# EAGLE schematic MSP-EXP430F5529LP (EAGLE 6.5.0)

## Sheet 1 of 3
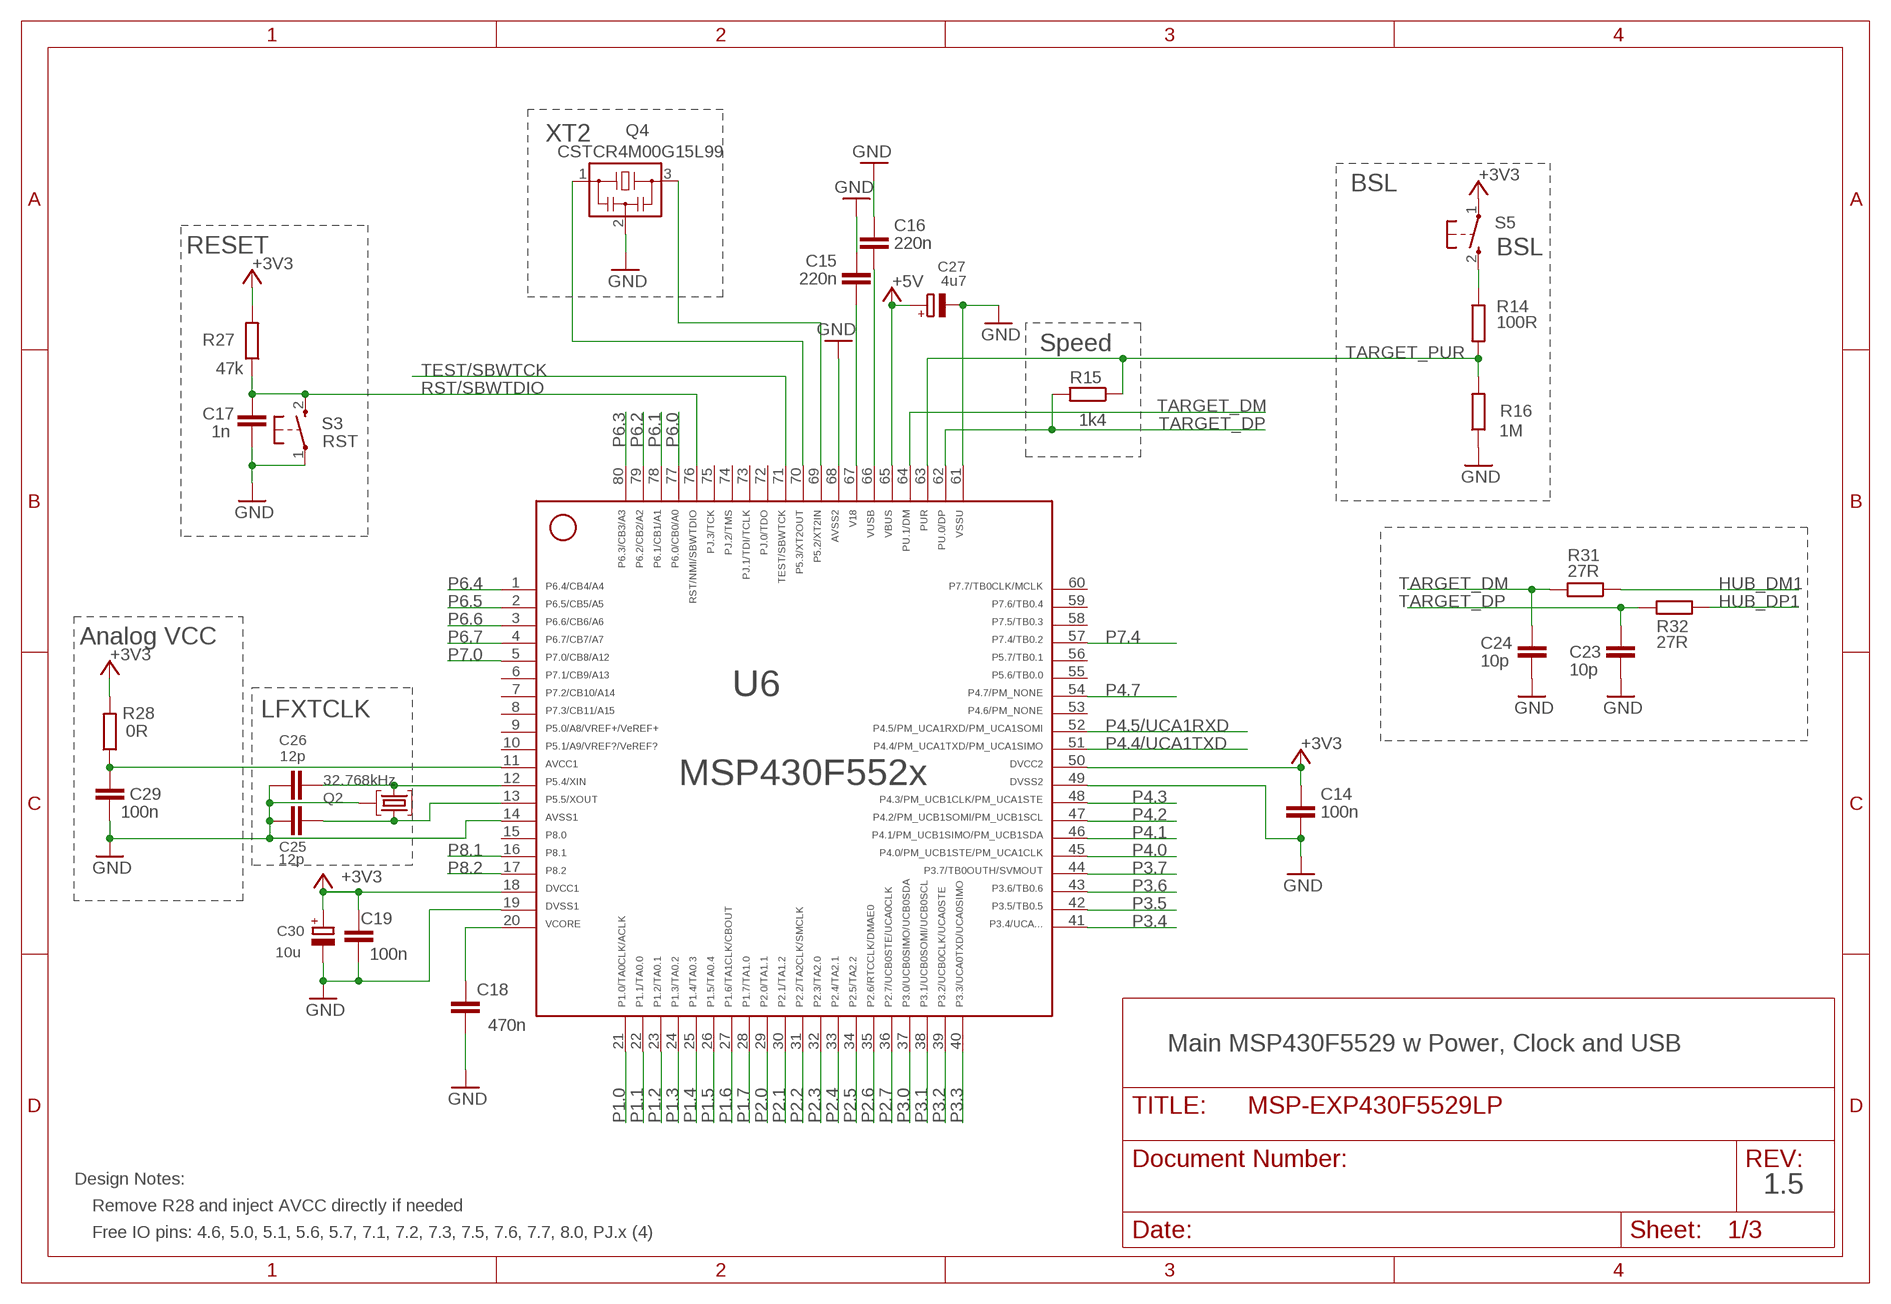
[diagram p0: schematic, sheet 1]

### Parts
C14  100n  C-EUC0402  [C0402]
C15  220n  C-EUC0402  [C0402]
C16  220n  C-EUC0402  [C0402]
C17  1n  C-EUC0402  [C0402]
C18  470n  C-EUC0402  [C0402]
C19  100n  C-EUC0402  [C0402]
C23  10p  C-EUC0402  [C0402]
C24  10p  C-EUC0402  [C0402]
C25  12p  C-EUC0402  [C0402]
C26  12p  C-EUC0402  [C0402]
C27  4u7  CPOL-EUA/3216-18R  [A/3216-18R]
C29  100n  C-EUC0402  [C0402]
C30  10u  CPOL-EUA/3216-18R  [A/3216-18R]
Q2  32.768kHz  MS3V-T1R  [MS3V-T1R]
Q4  CSTCR4M00G15L99  MURATA-FILTER_CSTCR6M00G53Z  [MURATA-FILTER_CSTCR]
R14  100R  R-EU_R0402  [R0402]
R15  1k4  R-EU_R0402  [R0402]
R16  1M  R-EU_R0402  [R0402]
R27  47k  R-EU_R0402  [R0402]
R28  0R  R-EU_R0402  [R0402]
R31  27R  R-EU_R0402  [R0402]
R32  27R  R-EU_R0402  [R0402]
S3  RST  PB  [PBTH]
S5  BSL  PB  [PBTH]
U6  MSP430F5529IPNR  F552X---PN80  [PN80]

### Nets
+3V3 [Power]: C14.1 C19.2 C30.+ R27.2 R28.2 S5.1(P) U6.18 U6.50 ; also sheet 2
+5V [Power]: C27.+ U6.65 ; also sheet 2
AVCC [Power]: C29.1 R28.1 U6.11
GND [Ground]: C14.2 C15.2 C16.2 C17.2 C18.1 C19.1 C23.2 C24.2 C25.1 C26.1 C27.- C29.2 C30.- Q2.P3(GND) Q4.2 R16.1 S3.1(P) U6.14 U6.19 U6.49 U6.61 U6.68 ; also sheet 2,3
HUB_DM1: R31.1
HUB_DP1: R32.1
N$4: R14.1 S5.2(S)
P1.0: U6.21
P1.1: U6.22
P1.2: U6.23
P1.3: U6.24
P1.4: U6.25
P1.5: U6.26
P1.6: U6.27
P1.7: U6.28
P2.0: U6.29
P2.1: U6.30
P2.2: U6.31
P2.3: U6.32
P2.4: U6.33
P2.5: U6.34
P2.6: U6.35
P2.7: U6.36
P3.0: U6.37
P3.1: U6.38
P3.2: U6.39
P3.3: U6.40
P3.4: U6.41
P3.5: U6.42
P3.6: U6.43
P3.7: U6.44
P4.0: U6.45
P4.1: U6.46
P4.2: U6.47
P4.3: U6.48
P4.4/UCA1TXD: U6.51
P4.5/UCA1RXD: U6.52
P4.7: U6.54
P5.2/XT2IN: Q4.3 U6.69
P5.3/XT2OUT: Q4.1 U6.70
P5.4/XIN: C26.2 Q2.P2 U6.12
P5.5/XOUT: C25.2 Q2.P1 U6.13
P6.0: U6.77
P6.1: U6.78
P6.2: U6.79
P6.3: U6.80
P6.4: U6.1
P6.5: U6.2
P6.6: U6.3
P6.7: U6.4
P7.0: U6.5
P7.4: U6.57
P8.1: U6.16
P8.2: U6.17
RST/SBWTDIO: C17.1 R27.1 S3.2(S) U6.76
TARGET_DM: C24.1 R31.2 U6.64
TARGET_DP: C23.1 R15.2 R32.2 U6.62
TARGET_PUR: R14.2 R15.1 R16.2 U6.63
TARGET_VUSB [Power]: C16.1 U6.66
TEST/SBWTCK: U6.71
V18 [Power]: C15.1 U6.67
VCORE [Power]: C18.2 U6.20
Unconnected: U6.6 U6.7 U6.8 U6.9 U6.10 U6.15 U6.53 U6.55 U6.56 U6.58 U6.59 U6.60 U6.72 U6.73 U6.74 U6.75

### Notes on the sheet
- XT2
- BSL
- RESET
- Speed
- Analog VCC
- LFXTCLK
- Main MSP430F5529 w Power, Clock and USB
- Design Notes:
- 1.5
- Remove R28 and inject AVCC directly if needed
- Free IO pins: 4.6, 5.0, 5.1, 5.6, 5.7, 7.1, 7.2, 7.3, 7.5, 7.6, 7.7, 8.0, PJ.x (4)

## Sheet 2 of 3
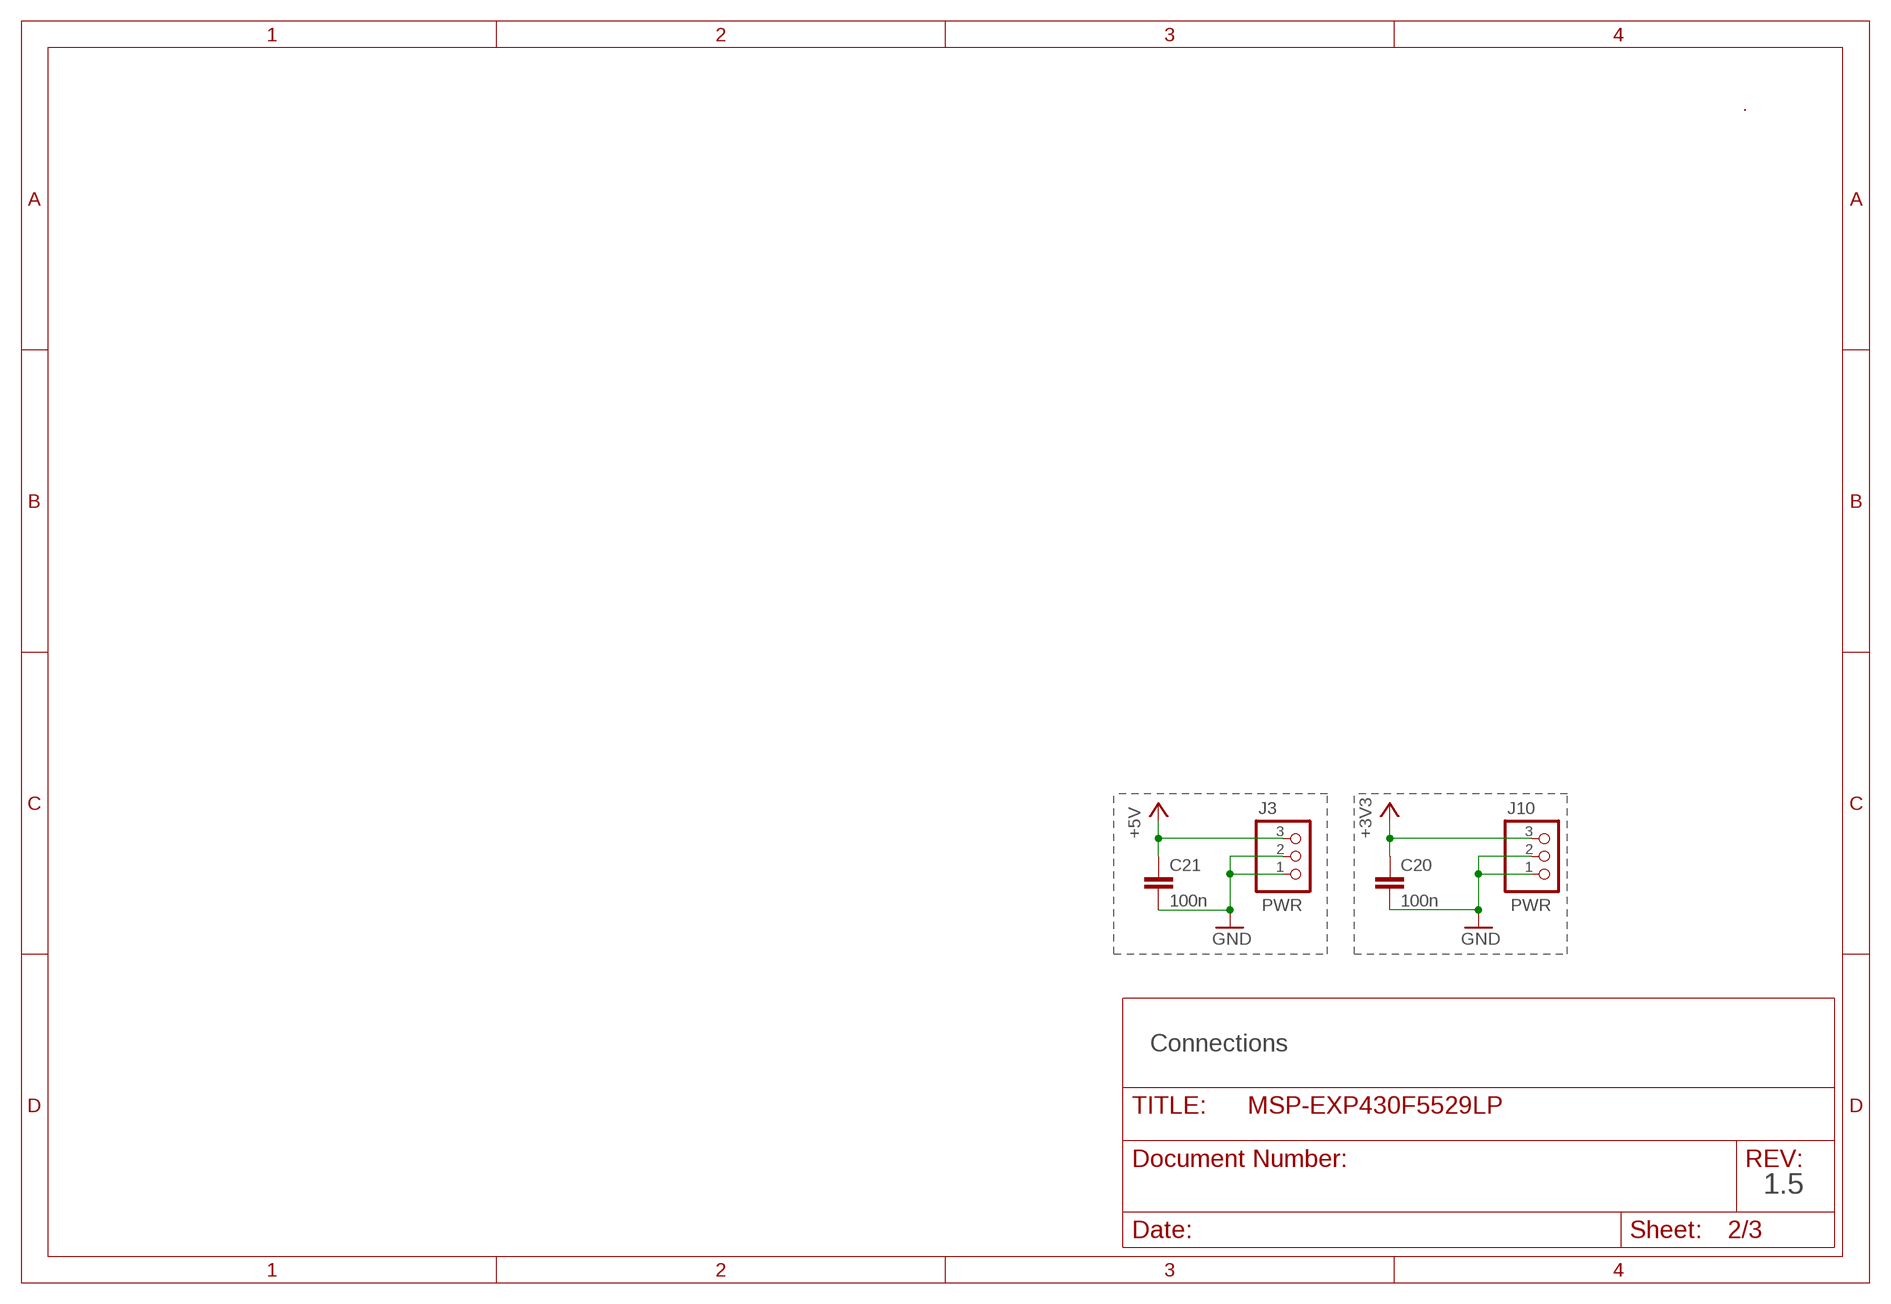
[diagram p1: schematic, sheet 2]

### Parts
C20  100n  C-EUC0402  [C0402]
C21  100n  C-EUC0402  [C0402]
J3  PWR  PINHD-1X3  [1X03]
J10  PWR  PINHD-1X3  [1X03]
U$3  5529_REAR_SILK_REV1_5_FINAL  [5529_REAR_SILK_REV1_5_FINAL]

### Nets
+3V3 [Power]: C20.1 J10.3 ; also sheet 1
+5V [Power]: C21.1 J3.3 ; also sheet 1
GND [Ground]: C20.2 C21.2 J3.1 J3.2 J10.1 J10.2 ; also sheet 1,3

### Notes on the sheet
- Connections
- 1.5

## Sheet 3 of 3
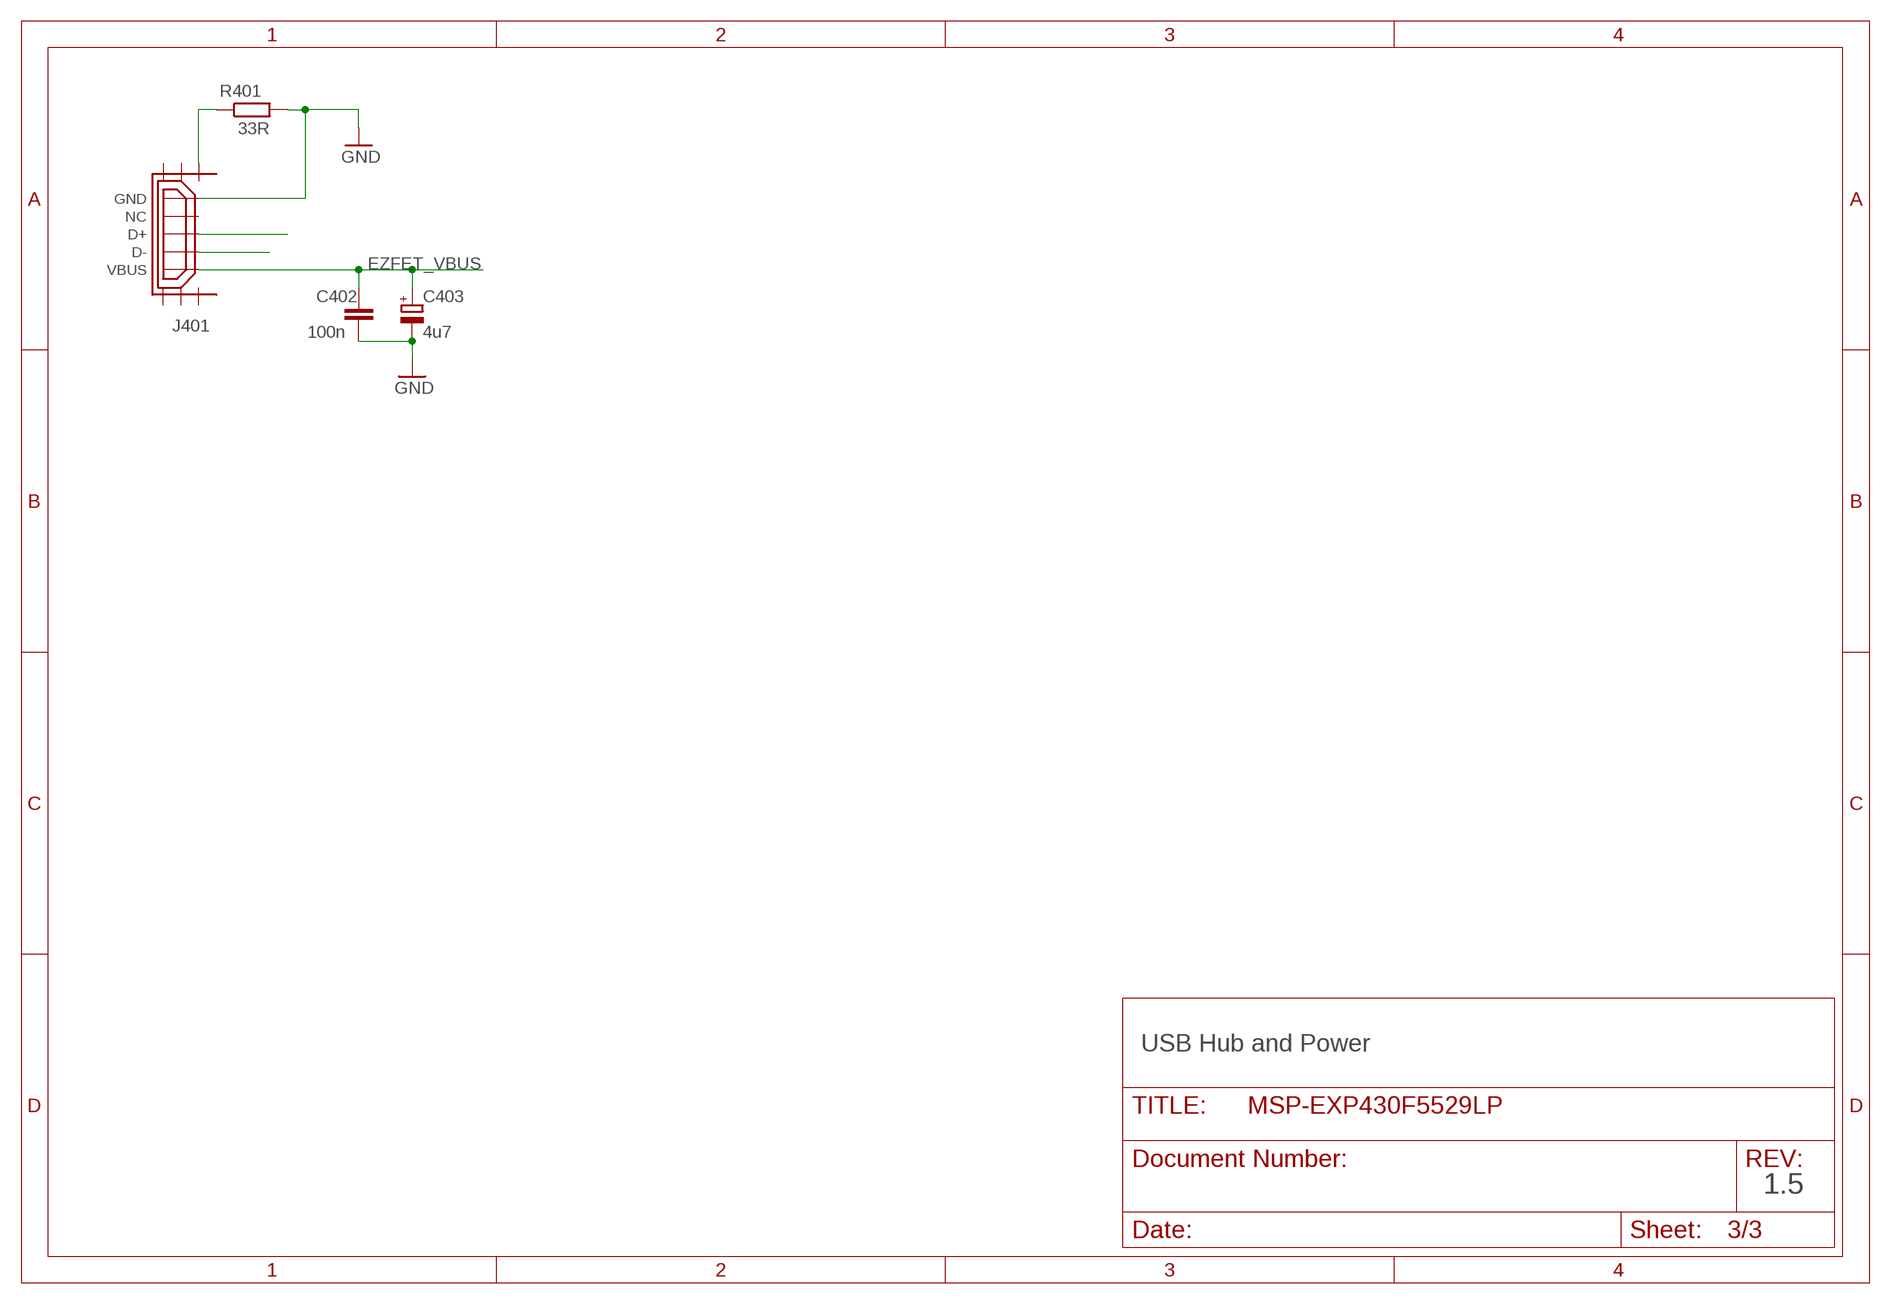
[diagram p2: schematic, sheet 3]

### Parts
C402  100n  C-EUC0402  [C0402]
C403  4u7  CPOL-EUA/3216-18R  [A/3216-18R]
J401  USB_MICRO_FLIPPED  [HIROSE-ZX62R-B-5P]
R401  33R  R-EU_R0402  [R0402]

### Nets
EZFET_VBUS [Power]: C402.1 C403.+ J401.VBUS
GND [Ground]: C402.2 C403.- J401.GND R401.2 ; also sheet 1,2
N$10: J401.SHIELD1 R401.1
N$12: J401.D+
N$13: J401.D-
Unconnected: J401.NC J401.SHIELD2 J401.SHIELD3 J401.SHIELD4 J401.SHIELD5 J401.SHIELD6

### Notes on the sheet
- USB Hub and Power
- 1.5

## Library data of the parts
C14-C21 C23-C26 C29 C402 = rcl:C-EU: CAPACITOR, European symbol
C27 C30 C403 = rcl:CPOL-EU: POLARIZED CAPACITOR, European symbol
J3 J10 = pinhead:PINHD-1X3: PIN HEADER
J401 = usb_con-update:USB_MICRO_FLIPPED
Q2 = microcrystal:MS3V-T1R
Q4 = murata:MURATA-FILTER_CSTCR: Resonator Source: murata.co.jp; MPN: CSTCR6M00G53-R0; OC_FARNELL: 1170434; OC_NEWARK: 25M8759
R14-R16 R27 R28 R31 R32 R401 = rcl:R-EU_: RESISTOR, European symbol
S3 S5 = electricalmeter:PB: OMRON SWITCH
U6 = TI_MSP430_v16_intern:F552X---PN80: ***MSP430F552X***PN80 http://www.ti.com/lit/gpn/msp430f5529 Rev1.0 06/2010 For F552X where X is 1,5,7,9
U$3 = LP_Silkscreen:5529_REAR_SILK_REV1_5_FINAL

## Net classes
0 Default: width 0.203 mm, drill 0.305 mm, clearance 0.152 mm
1 Ground: width 0.203 mm, drill 0.305 mm, clearance 0.152 mm to class 0, clearance 0.152 mm
2 Power: width 0.203 mm, drill 0.305 mm, clearance 0.152 mm to class 0, clearance 0.152 mm to class 1, clearance 0.152 mm